# EAGLE schematic FeerPong (EAGLE 7.5.0)
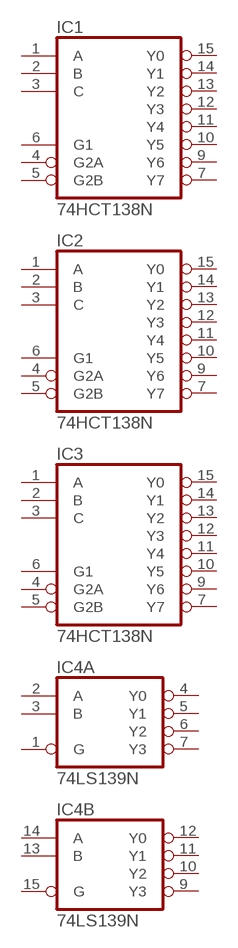
[diagram p0: schematic, sheet 1]

## Parts
IC1  74HCT138N  [DIL16]
IC2  74HCT138N  [DIL16]
IC3  74HCT138N  [DIL16]
IC4  74LS139N  [DIL16]
Unconnected: IC1.1(A) IC1.2(B) IC1.3(C) IC1.4(G2A) IC1.5(G2B) IC1.6(G1) IC1.7(Y7) IC1.9(Y6) IC1.10(Y5) IC1.11(Y4) IC1.12(Y3) IC1.13(Y2) IC1.14(Y1) IC1.15(Y0) IC2.1(A) IC2.2(B) IC2.3(C) IC2.4(G2A) IC2.5(G2B) IC2.6(G1) IC2.7(Y7) IC2.9(Y6) IC2.10(Y5) IC2.11(Y4) IC2.12(Y3) IC2.13(Y2) IC2.14(Y1) IC2.15(Y0) IC3.1(A) IC3.2(B) IC3.3(C) IC3.4(G2A) IC3.5(G2B) IC3.6(G1) IC3.7(Y7) IC3.9(Y6) IC3.10(Y5) IC3.11(Y4) IC3.12(Y3) IC3.13(Y2) IC3.14(Y1) IC3.15(Y0) IC4.1(A:G) IC4.2(A:A) IC4.3(A:B) IC4.4(A:Y0) IC4.5(A:Y1) IC4.6(A:Y2) IC4.7(A:Y3) IC4.9(B:Y3) IC4.10(B:Y2) IC4.11(B:Y1) IC4.12(B:Y0) IC4.13(B:B) IC4.14(B:A) IC4.15(B:G)

## Power pins joined to a net without a drawn wire
GND: IC1.8(GND) IC2.8(GND) IC3.8(GND) IC4.8(P:GND)
VCC: IC1.16(VCC) IC2.16(VCC) IC3.16(VCC) IC4.16(P:VCC)

## Library data of the parts
IC1-IC3 = 74xx-eu:74*138: 3-line to 8-line DECODER/DEMULTIPLEXER
IC4 = 74xx-eu:74*139: Dual 2-line to 4-line DECODER/DEMULTIPLEXER